# Altium schematic sheet 05_IO_CONN.SchDoc: IO CONN
size A4; Date: 20/11/2014; Author: HuangRui <vowstar@gmail.com>; DrawnBy: JiYaping <jyp1817@gmail.com>; Organization: WWW.NODEMCU.COM
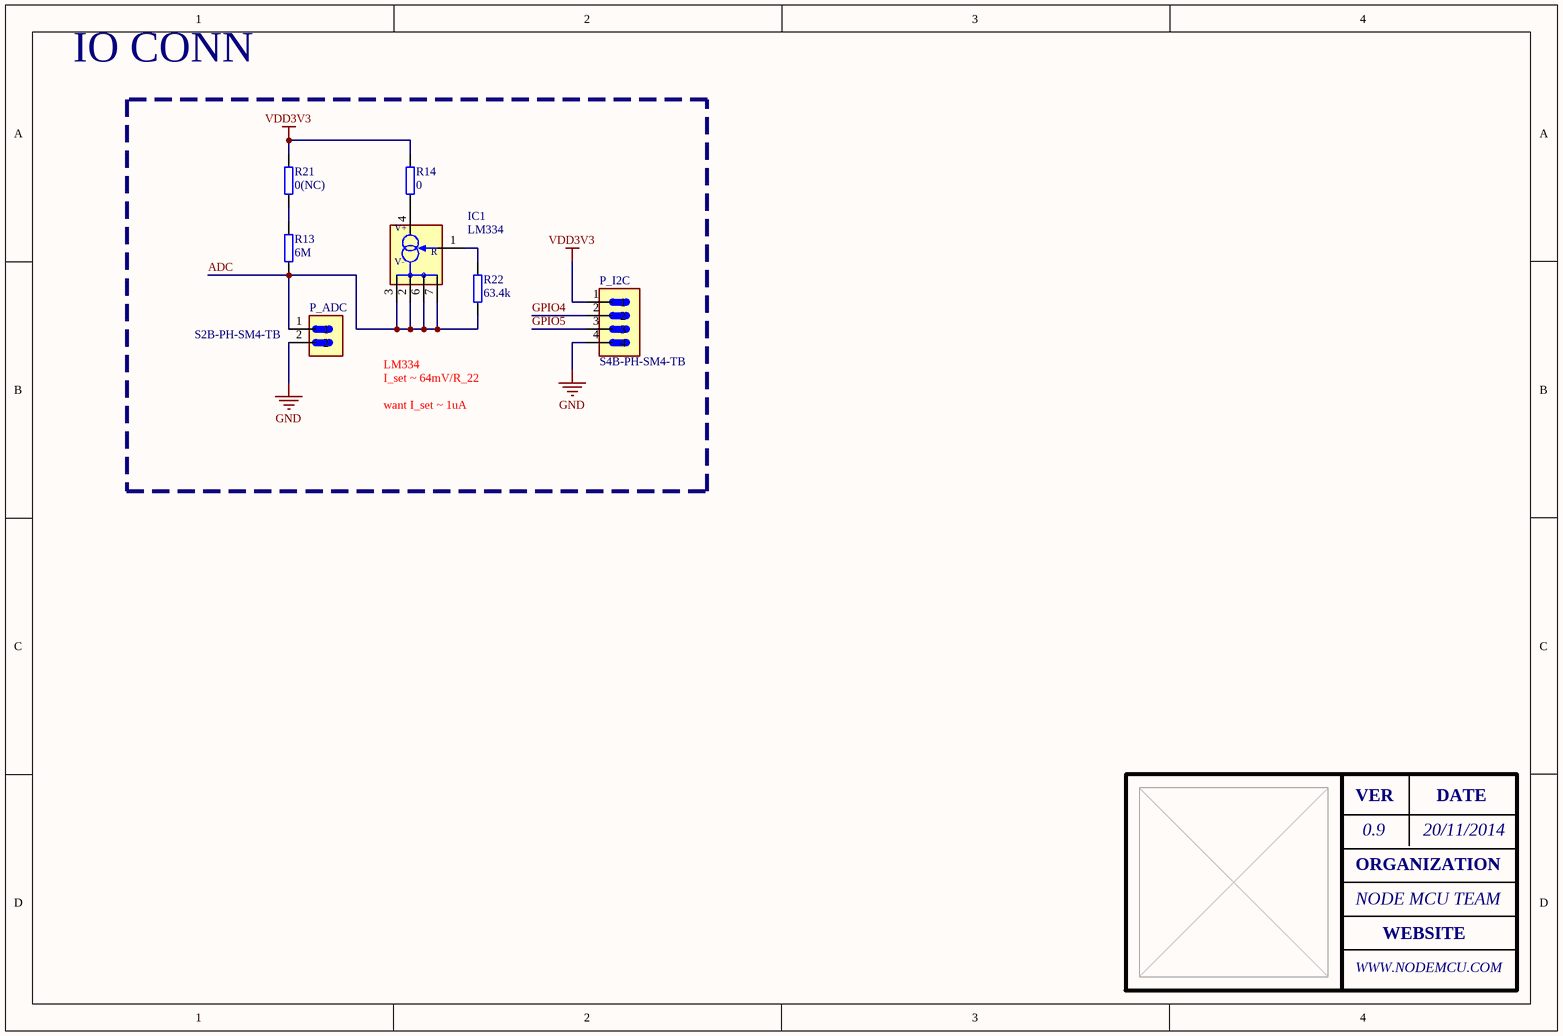
[diagram p0: 05_IO_CONN.SchDoc]

## Parts
IC1  LM334  [SO08]
P_ADC  S2B-PH-SM4-TB  [JST_S2B-PH-SM4-TB]
P_I2C  S4B-PH-SM4-TB  [JST_S4B-PH-SM4-TB]
R13  6M  [SMT_R_0402]
R14  0  [SMT_R_0402]
R21  0(NC)  [SMT_R_0402]
R22  63.4k  [SMT_R_0402]

## Nets
GND: P_ADC.2 P_I2C.4
VDD3V3: P_I2C.1 R14.2 R21.2
ADC: IC1.2(V-) IC1.3(V-@1) IC1.6(V-@2) IC1.7(V-@3) P_ADC.1 R13.1 R22.1
GPIO4: P_I2C.2
GPIO5: P_I2C.3
NetIC1_1: IC1.1(R) R22.2
NetIC1_4: IC1.4(V+) R14.1
NetR13_2: R13.2 R21.1

## Notes on the sheet
- LM334
  I_set ~ 64mV/R_22
  want I_set ~ 1uA
- VER
- 0.9
- DATE
- ORGANIZATION
- NODE MCU TEAM
- WEBSITE

## Library data of the parts
IC1 = LM334: Current Source Regulator Adjustable 8-SOIC; MF: Texas Instruments; SnapEDA_Link: https://www.snapeda.com/parts/LM334/Texas%20Instruments/view-part/681076/?ref=snap; Availability: Unavailable; Price: None; Value: *; MP: LM334; Package: SOIC-8 Texas Instruments
P_ADC = S2B-PH-SM4-TB: Connector Header Surface Mount, Right Angle 2 position 0.079 _2.00mm_; MF: JST Sales; SnapEDA_Link: https://www.snapeda.com/parts/S2B-PH-SM4-TB/JST%20Sales%20America%20Inc./view-part/225866/?ref=snap; Value: *; Price: None; Availability: Unavailable; MP: S2B-PH-SM4-TB; Package: None
P_I2C = S4B-PH-SM4-TB: Connector Header Surface Mount, Right Angle 4 position 0.079 _2.00mm_; MF: JST Sales; Package: None; Value: *; Availability: Unavailable; SnapEDA_Link: https://www.snapeda.com/parts/S4B-PH-SM4-TB/JST%20Sales%20America%20Inc./view-part/473686/?ref=snap; Price: None; MP: S4B-PH-SM4-TB
R13 R14 R21 R22 = SMT_R_0402: Surface mount resistor 0402